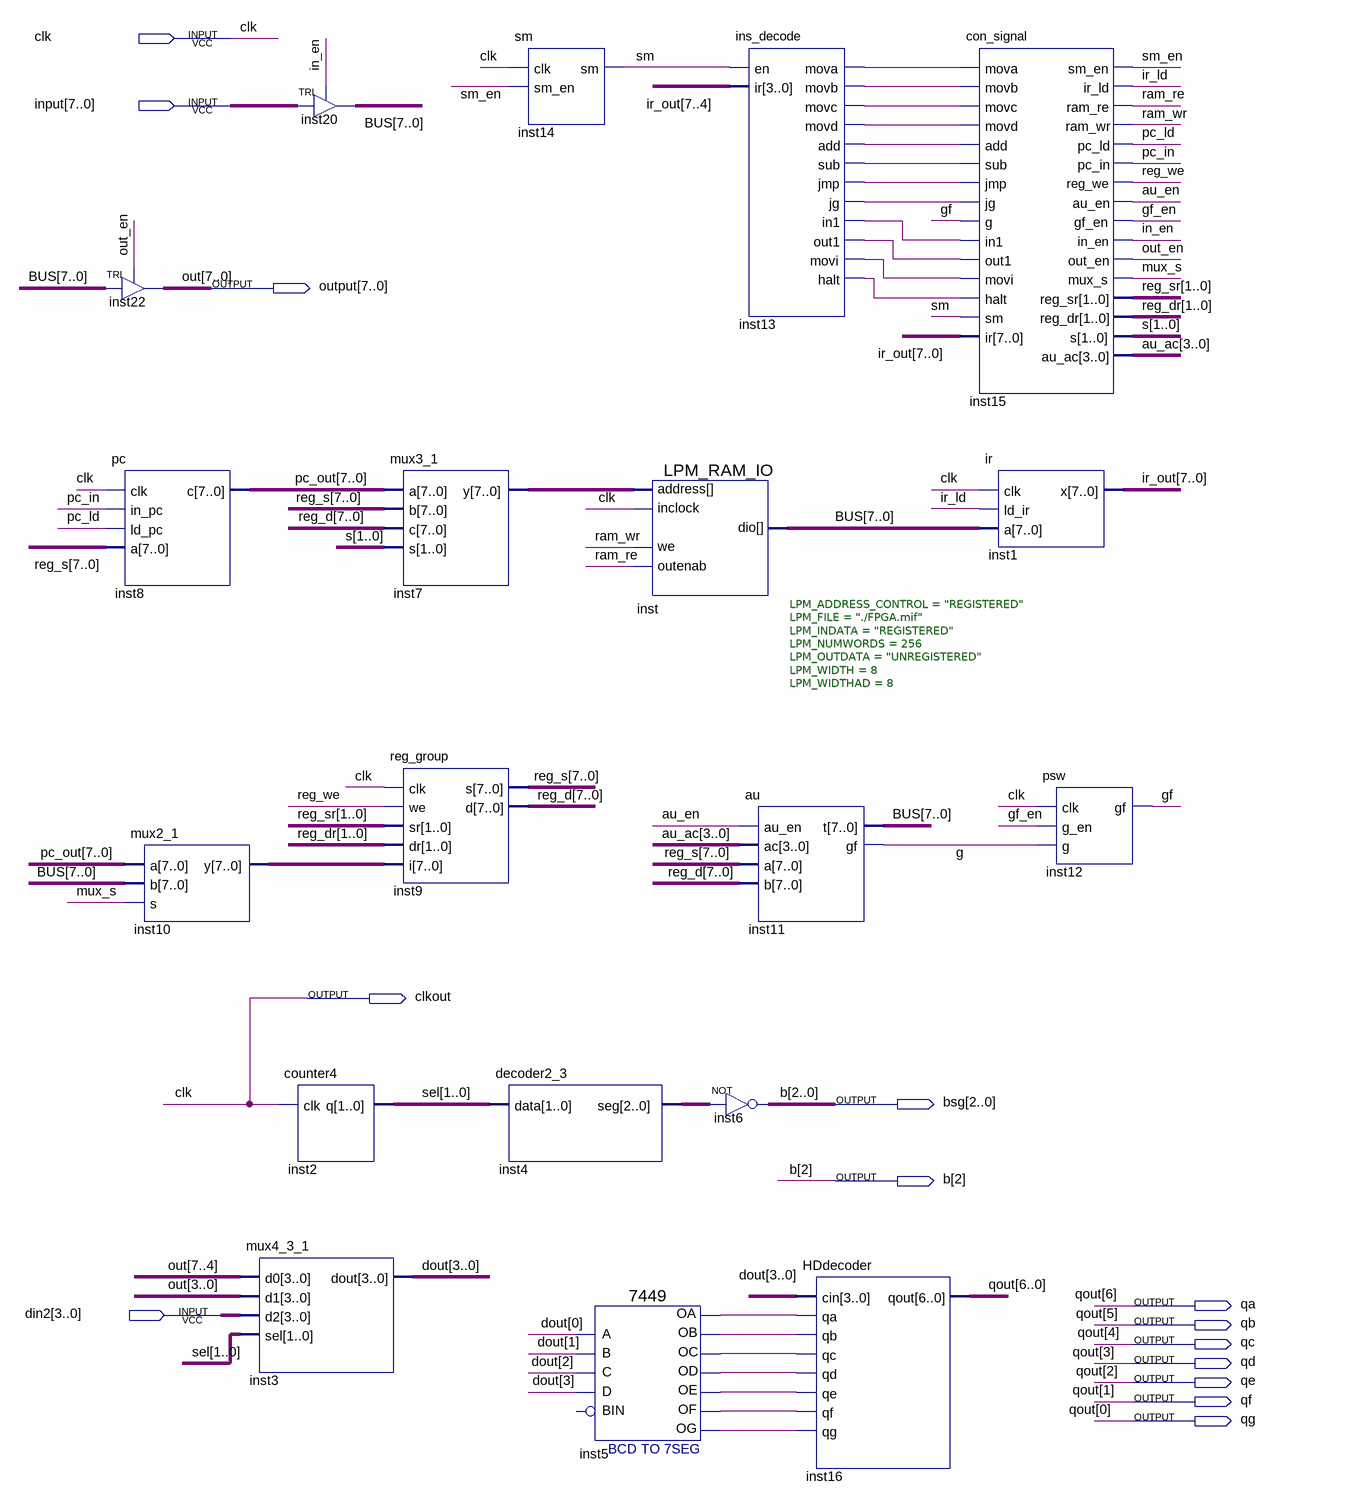
[diagram p0: schematic sheet]
// Quartus schematic myComputer.bdf as structural Verilog: 19 symbols, 14 pins
module myComputer (
  input  clk,
  input  [7:0] \input ,
  input  [3:0] din2,
  output [7:0] \output ,
  output clkout,
  output [2:0] bsg,
  output [2:2] b,
  output qa,
  output qb,
  output qc,
  output qd,
  output qe,
  output qf,
  output qg
);

  wire au_en, g, gf, gf_en, in_en, inst5_oa, inst5_ob, inst5_oc, inst5_od, inst5_oe, inst5_of, inst5_og,
       inst13_add, inst13_halt, inst13_in1, inst13_jg, inst13_jmp, inst13_mova, inst13_movb, inst13_movc,
       inst13_movd, inst13_movi, inst13_out1, inst13_sub, ir_ld, mux_s, out_en, pc_in, pc_ld, ram_re, ram_wr,
       reg_we, sm, sm_en;
  wire [1:0] reg_dr, reg_sr, s, sel;
  wire [2:0] inst4_seg;
  wire [3:0] au_ac, dout;
  wire [7:0] BUS, inst7_y, inst10_y, ir_out, pc_out, reg_d, reg_s;

  TRI inst22[7:0] (.IN(BUS), .OE(out_en), .OUT(\output ));
  pc inst8 (.clk(clk), .in_pc(pc_in), .ld_pc(pc_ld), .a(reg_s), .c(pc_out));
  mux2_1 inst10 (.a(pc_out), .b(BUS), .s(mux_s), .y(inst10_y));
  mux4_3_1 inst3 (.d0(\output [7:4]), .d1(\output [3:0]), .d2(din2), .sel(sel), .dout(dout));
  TRI inst20[7:0] (.IN(\input ), .OE(in_en), .OUT(BUS));
  counter4 inst2 (.clk(clk), .q(sel));
  mux3_1 inst7 (.a(pc_out), .b(reg_s), .c(reg_d), .s(s), .y(inst7_y));
  reg_group inst9 (.clk(clk), .we(reg_we), .sr(reg_sr), .dr(reg_dr), .i(inst10_y), .s(reg_s), .d(reg_d));
  decoder2_3 inst4 (.data(sel), .seg(inst4_seg));
  sm inst14 (.clk(clk), .sm_en(sm_en), .sm(sm));
  \7449  inst5 (
    .A(dout[0]), .C(dout[2]), .B(dout[1]), .D(dout[3]), .OC(inst5_oc), .OD(inst5_od), .OF(inst5_of),
    .OG(inst5_og), .OB(inst5_ob), .OA(inst5_oa), .OE(inst5_oe));  // open: BIN
  LPM_RAM_IO #(.LPM_ADDRESS_CONTROL("REGISTERED"), .LPM_FILE("./FPGA.mif"), .LPM_INDATA("REGISTERED"), .LPM_NUMWORDS(256), .LPM_OUTDATA("UNREGISTERED"), .LPM_WIDTH(8), .LPM_WIDTHAD(8)) inst (
    .address(inst7_y), .inclock(clk), .we(ram_wr), .outenab(ram_re), .dio(BUS));
  ins_decode inst13 (
    .en(sm), .ir(ir_out[7:4]), .mova(inst13_mova), .movb(inst13_movb), .movc(inst13_movc),
    .movd(inst13_movd), .add(inst13_add), .sub(inst13_sub), .jmp(inst13_jmp), .jg(inst13_jg),
    .in1(inst13_in1), .out1(inst13_out1), .movi(inst13_movi), .halt(inst13_halt));
  assign {b[2], bsg[1:0]} = ~inst4_seg;  // NOT inst6, 3 bits wide
  au inst11 (.au_en(au_en), .ac(au_ac), .a(reg_s), .b(reg_d), .t(BUS), .gf(g));
  HDdecoder inst16 (
    .cin(dout), .qa(inst5_oa), .qb(inst5_ob), .qc(inst5_oc), .qd(inst5_od), .qe(inst5_oe), .qf(inst5_of),
    .qg(inst5_og), .qout({qa, qb, qc, qd, qe, qf, qg}));
  con_signal inst15 (
    .mova(inst13_mova), .movb(inst13_movb), .movc(inst13_movc), .movd(inst13_movd), .add(inst13_add),
    .sub(inst13_sub), .jmp(inst13_jmp), .jg(inst13_jg), .g(gf), .in1(inst13_in1), .out1(inst13_out1),
    .movi(inst13_movi), .halt(inst13_halt), .sm(sm), .ir(ir_out), .sm_en(sm_en), .ir_ld(ir_ld),
    .ram_re(ram_re), .ram_wr(ram_wr), .pc_ld(pc_ld), .pc_in(pc_in), .reg_we(reg_we), .au_en(au_en),
    .gf_en(gf_en), .in_en(in_en), .out_en(out_en), .mux_s(mux_s), .reg_sr(reg_sr), .reg_dr(reg_dr), .s(s),
    .au_ac(au_ac));
  ir inst1 (.clk(clk), .ld_ir(ir_ld), .a(BUS), .x(ir_out));
  psw inst12 (.clk(clk), .g_en(gf_en), .g(g), .gf(gf));

  assign bsg[2] = b[2];
  assign clkout = clk;

  // Other names for the same wires on the sheet: b[1:0] = bsg[1:0]; out[7:0] = \output ;
  //   qout[6:0] = {qa, qb, qc, qd, qe, qf, qg}
endmodule
